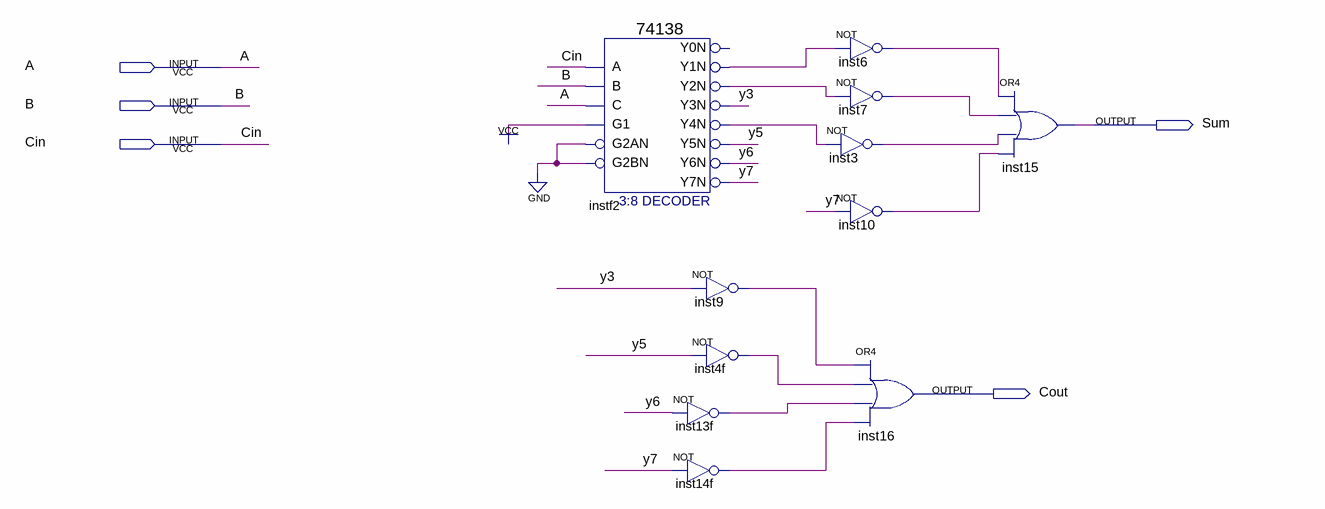
[diagram p0: schematic sheet]
// Quartus schematic FullAdder.bdf as structural Verilog: 11 symbols, 5 pins
module FullAdder (
  input  A,
  input  B,
  input  Cin,
  output Sum,
  output Cout
);

  wire inst3_out, inst4f_out, inst6_out, inst7_out, inst9_out, inst10_out, inst13f_out, inst14f_out,
       instf2_y1n, instf2_y2n, instf2_y4n, y3, y5, y6, y7;

  \74138  instf2 (
    .A(Cin), .B(B), .G1(1'b1), .C(A), .G2AN(1'b0), .G2BN(1'b0), .Y1N(instf2_y1n), .Y2N(instf2_y2n), .Y3N(y3),
    .Y4N(instf2_y4n), .Y5N(y5), .Y6N(y6), .Y7N(y7));  // open: Y0N
  not inst9 (inst9_out, y3);
  not inst4f (inst4f_out, y5);
  not inst13f (inst13f_out, y6);
  not inst14f (inst14f_out, y7);
  not inst6 (inst6_out, instf2_y1n);
  not inst7 (inst7_out, instf2_y2n);
  not inst3 (inst3_out, instf2_y4n);
  not inst10 (inst10_out, y7);
  or inst16 (Cout, inst9_out, inst4f_out, inst13f_out, inst14f_out);
  or inst15 (Sum, inst6_out, inst7_out, inst3_out, inst10_out);
endmodule
